# EAGLE design LED-card-1E (EAGLE 7.7.0)
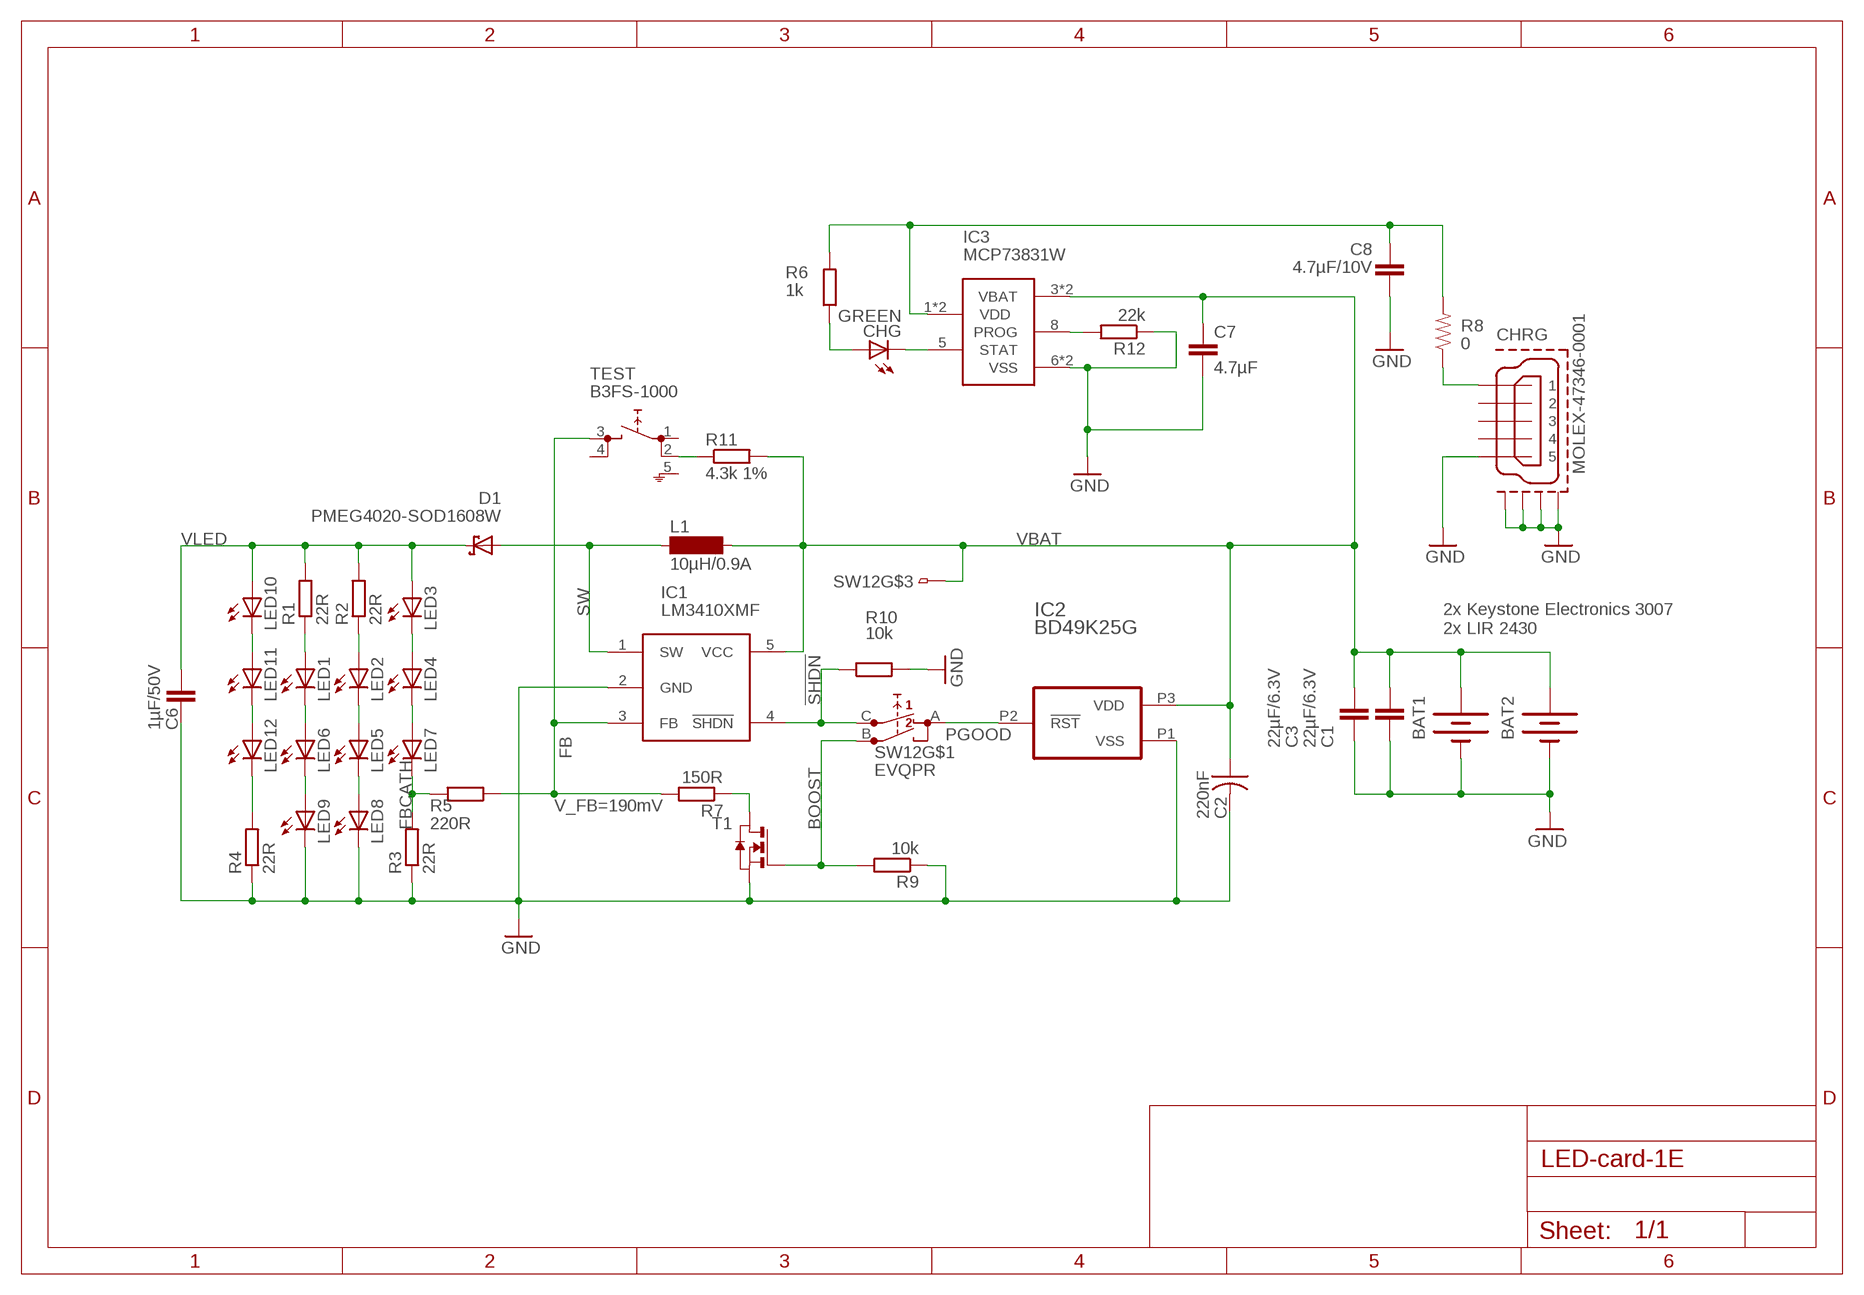
[diagram p0: schematic, sheet 1]

## Parts
BAT1  BATTERY  [BATTCON_245MM]
BAT2  BATTERY  [BATTCON_245MM]
C1  22µF/6.3V  C-EUC0805K  [C0805K]
C2  220nF  C-USC0805K  [C0805K]
C3  22µF/6.3V  C-EUC0805K  [C0805K]
C6  1µF/50V  C-EUC0805K  [C0805K]
C7  4.7µF  C-EUC0603K  [C0603K]
C8  4.7µF/10V  C-EUC0603K  [C0603K]
CHG  GREEN  LEDCHIPLED-0603-TTW  [CHIPLED-0603-TTW]
CHRG  MOLEX-47346-0001  [MOLEX-47364-0001]
D1  PMEG4020-SOD1608W  [SOD1608W]
IC1  LM3410XMF  FAN5333  [SOT23-5L]
IC2  BD49K25G  BD49KG  [SOT-23]
IC3  MCP73831W  [DFN8W]
L1  10µH/0.9A  MS50  [MS50]
LED1  LEDSML1206  [SML1206]
LED2  LEDSML1206  [SML1206]
LED3  LEDSML1206  [SML1206]
LED4  LEDSML1206  [SML1206]
LED5  LEDSML1206  [SML1206]
LED6  LEDSML1206  [SML1206]
LED7  LEDSML1206  [SML1206]
LED8  LEDSML1206  [SML1206]
LED9  LEDSML1206  [SML1206]
LED10  LEDSML1206  [SML1206]
LED11  LEDSML1206  [SML1206]
LED12  LEDSML1206  [SML1206]
R1  22R  R-EU_R0805  [R0805]
R2  22R  R-EU_R0805  [R0805]
R3  22R  R-EU_R0805  [R0805]
R4  22R  R-EU_R0805  [R0805]
R5  220R  R-EU_R0603  [R0603]
R6  1k  R-EU_R0603  [R0603]
R7  150R  R-EU_R0603  [R0603]
R8  0  RESISTOR0805-RES  [0805]
R9  10k  R-EU_R0603  [R0603]
R10  10k  R-EU_R0603  [R0603]
R11  4.3k 1%  R-EU_R0603  [R0603]
R12  22k  R-EU_R0603  [R0603]
SW12  EVQPR  [EVQPR-GND]
T1  NMOSSOT23  [SOT-23]
TEST  B3FS-1000  SKHMPSE010  [SKHMPXE010]

## Nets
!SHDN: IC1.4(!SHDN) R10.1 SW12.C(1.1)
BOOST: R9.2 SW12.B(1.2) T1.3(G)
FB: IC1.3(FB) R5.1 R7.2 TEST.3(2.1)
FBCATH: LED7.C R3.2 R5.2
FBLO: R7.1 T1.1(D)
GND: BAT1.2(-) BAT2.2(-) C1.2 C2.2 C3.2 C6.2 C7.2 C8.2 CHRG.5 CHRG.GND1 CHRG.GND2 CHRG.GND3 CHRG.GND4 IC1.2(GND) IC2.P1(VSS) IC3.6(VSS) IC3.GND(VSS) LED8.C LED9.C R3.1 R4.1 R9.1 R10.2 R12.1 T1.2(S)
N$1: R11.1 TEST.2(1.2)
N$2: IC3.8(PROG) R12.2
N$3: LED1.A R1.1
N$4: LED3.C LED4.A
N$5: LED2.C LED5.A
N$6: LED1.C LED6.A
N$7: LED6.C LED9.A
N$8: LED5.C LED8.A
N$9: LED4.C LED7.A
N$10: CHG.C@1(C) IC3.5(STAT)
N$12: LED2.A R2.1
N$13: CHG.A@1(A) R6.1
N$15: CHRG.1 R8.1
N$16: LED10.C LED11.A
N$17: LED11.C LED12.A
N$18: LED12.C R4.2
PGOOD: IC2.P2(!RST) SW12.A(2.1)
SW: D1.A D1.A2(A) IC1.1(SW) L1.1
VBAT: BAT1.1(+) BAT1.3(+) BAT2.1(+) BAT2.3(+) C1.1 C2.1 C3.1 C7.1 IC1.5(VCC) IC2.P3(VDD) IC3.3(VBAT) IC3.4(VBAT) L1.2 R11.2 SW12.D
VBUS: C8.1 IC3.1(VDD) IC3.2(VDD) R6.2 R8.2
VLED: C6.1 D1.C D1.C2(C) LED3.A LED10.A R1.2 R2.2
Unconnected: CHRG.2 CHRG.3 CHRG.4 SW12.G(SH) TEST.1(1.1) TEST.4(2.2) TEST.5(SH)

## Notes on the sheet
- 2x Keystone Electronics 3007
  2x LIR 2430
- V_FB=190mV

## Library data of the parts
BAT1 BAT2 = custom-parts:BATTERY: Battery Holders Various common sizes : AA, AAA, 20mm coin cell and 12mm coin cell. 20MM_4LEGS, BATT-10373; MF: Keystone Electronics; MOUSER: 534-3007; MPN: 3007
C1 C3 C6-C8 = rcl:C-EU: CAPACITOR, European symbol
C2 = rcl:C-US: CAPACITOR, American symbol
CHG = led:LED: LED OSRAM: - CHIPLED LG R971, LG N971, LY N971, LG Q971, LY Q971, LO R971, LY R971 LH N974, LH R974 LS Q976, LO Q976, LY Q976 LO Q996 - Hyper CHIPLED LW Q18S LB Q993, LB Q99A, LB R99A - SideLED LS A670, LO A670, LY A670, LG A670, LP A670 LB A673, LV A673, LT A673, LW A673 LH A674 LY A675 LS A676, LA A676, LO A676, LY A676, LW A676 LS A679, LY A679, LG A679 - Hyper Micro SIDELED® LS Y876, LA Y876, LO Y876, LY Y876 LT Y87S - SmartLED LW L88C, LW L88S LB L89C, LB L89S, LG L890 LS L89K, LO L89K, LY L89K LS L896, LA L896, LO L896, LY L896 - TOPLED LS T670, LO T670, LY T670, LG T670, LP T670 LSG T670, LSP T670, LSY T670, LOP T670, LYG T670 LG T671, LOG T671, LSG T671 LB T673, LV T673, LT T673, LW T673 LH T674 LS T676, LA T676, LO T676, LY T676, LB T676, LH T676, LSB T676, LW T676 LB T67C, LV T67C, LT T67C, LS T67K, LO T67K, LY T67K, LW E67C LS E67B, LA E67B, LO E67B, LY E67B, LB E67C, LV E67C, LT E67C LW T67C LS T679, LY T679, LG T679 LS T770, LO T770, LY T770, LG T770, LP T770 LB T773, LV T773, LT T773, LW T773 LH T774 LS E675, LA E675, LY E675, LS T675 LS T776, LA T776, LO T776, LY T776, LB T776 LHGB T686 LT T68C, LB T68C - Hyper Mini TOPLED® LB M676 - Mini TOPLED Santana® LG M470 LS M47K, LO M47K, LY M47K Source: http://www.osram.convergy.de LUXEON: - LUMILED® LXK2-PW12-R00, LXK2-PW12-S00, LXK2-PW14-U00, LXK2-PW14-V00 LXK2-PM12-R00, LXK2-PM12-S00, LXK2-PM14-U00 LXK2-PE12-Q00, LXK2-PE12-R00, LXK2-PE12-S00, LXK2-PE14-T00, LXK2-PE14-U00 LXK2-PB12-K00, LXK2-PB12-L00, LXK2-PB12-M00, LXK2-PB14-N00, LXK2-PB14-P00, LXK2-PB14-Q00 LXK2-PR12-L00, LXK2-PR12-M00, LXK2-PR14-Q00, LXK2-PR14-R00 LXK2-PD12-Q00, LXK2-PD12-R00, LXK2-PD12-S00 LXK2-PH12-R00, LXK2-PH12-S00 LXK2-PL12-P00, LXK2-PL12-Q00, LXK2-PL12-R00 Source: www.luxeon.com KINGBRIGHT: KA-3528ASYC Source: www.kingbright.com
CHRG = usb_con-update:MOLEX-47346-0001: MICRO USB B, BOTTOM MOUNT
D1 = custom-parts:PMEG4020: SOD123W Schottky Rectifier; MF: Nexperia; MOUSER: 771-PMEG4020EPK,315; PN: PMEG4020EPK,315
IC1 = custom-parts:FAN5333; MF: Ti; MOUSER: 926-LM3410XMF/NOPB; MPN: LM3410XMF
IC2 = custom-parts:BD49K**G: Standard CMOS Voltage Detector IC Package Type SSOP3(1pin GND) variant Datasheet http://www.mouser.com/ds/2/348/bd48xxg-e-746174.pdf
IC3 = custom-parts:MCP73831: Miniature Single-Cell, Fully Integrated Li-Ion, Li-Polymer Charge Management Controllers
L1 = inductor-neosid:MS50: INDUCTOR SMD power inductor; MF: Taiyo Yuden; MOUSER: CBC3225T100KR; MPN: CBC3225T100KR; OC_FARNELL: unknown; OC_NEWARK: unknown
LED1-LED12 = led:LED: LED OSRAM: - CHIPLED LG R971, LG N971, LY N971, LG Q971, LY Q971, LO R971, LY R971 LH N974, LH R974 LS Q976, LO Q976, LY Q976 LO Q996 - Hyper CHIPLED LW Q18S LB Q993, LB Q99A, LB R99A - SideLED LS A670, LO A670, LY A670, LG A670, LP A670 LB A673, LV A673, LT A673, LW A673 LH A674 LY A675 LS A676, LA A676, LO A676, LY A676, LW A676 LS A679, LY A679, LG A679 - Hyper Micro SIDELED® LS Y876, LA Y876, LO Y876, LY Y876 LT Y87S - SmartLED LW L88C, LW L88S LB L89C, LB L89S, LG L890 LS L89K, LO L89K, LY L89K LS L896, LA L896, LO L896, LY L896 - TOPLED LS T670, LO T670, LY T670, LG T670, LP T670 LSG T670, LSP T670, LSY T670, LOP T670, LYG T670 LG T671, LOG T671, LSG T671 LB T673, LV T673, LT T673, LW T673 LH T674 LS T676, LA T676, LO T676, LY T676, LB T676, LH T676, LSB T676, LW T676 LB T67C, LV T67C, LT T67C, LS T67K, LO T67K, LY T67K, LW E67C LS E67B, LA E67B, LO E67B, LY E67B, LB E67C, LV E67C, LT E67C LW T67C LS T679, LY T679, LG T679 LS T770, LO T770, LY T770, LG T770, LP T770 LB T773, LV T773, LT T773, LW T773 LH T774 LS E675, LA E675, LY E675, LS T675 LS T776, LA T776, LO T776, LY T776, LB T776 LHGB T686 LT T68C, LB T68C - Hyper Mini TOPLED® LB M676 - Mini TOPLED Santana® LG M470 LS M47K, LO M47K, LY M47K Source: http://www.osram.convergy.de LUXEON: - LUMILED® LXK2-PW12-R00, LXK2-PW12-S00, LXK2-PW14-U00, LXK2-PW14-V00 LXK2-PM12-R00, LXK2-PM12-S00, LXK2-PM14-U00 LXK2-PE12-Q00, LXK2-PE12-R00, LXK2-PE12-S00, LXK2-PE14-T00, LXK2-PE14-U00 LXK2-PB12-K00, LXK2-PB12-L00, LXK2-PB12-M00, LXK2-PB14-N00, LXK2-PB14-P00, LXK2-PB14-Q00 LXK2-PR12-L00, LXK2-PR12-M00, LXK2-PR14-Q00, LXK2-PR14-R00 LXK2-PD12-Q00, LXK2-PD12-R00, LXK2-PD12-S00 LXK2-PH12-R00, LXK2-PH12-S00 LXK2-PL12-P00, LXK2-PL12-Q00, LXK2-PL12-R00 Source: www.luxeon.com KINGBRIGHT: KA-3528ASYC Source: www.kingbright.com; MF: WE; MOUSER: 710-158301260; MPN: 158301260
R1-R7 R9-R12 = rcl:R-EU_: RESISTOR, European symbol
R8 = SparkFun-Passives:RESISTOR: Resistor Basic schematic elements and footprints for 0603, 1206, and PTH resistors.
SW12 = custom-parts:EVQPR: Panasonic Light Touch Switches/EVQPR/Q0/3PR Features optional boss (EVQP-R7, EVQ-3PR, EVQ-PR9, EVQ-PRH) optional GND shield terminal (EVQP-PR5, EVQP- PRD, EVQP-PR9, EVQP-PRH) optional push plate (A10) Datasheet all models : EVQP-PRBA10, EVQP-Q04A10, EVQP-PR7A10, EVQP-3PRA10, EVQP-PR5A10, EVQP-PRDA10, EVQP-PR9A10, EVQP-PRHA10, EVQP-PRBA09, EVQP-Q04A09, EVQP-PR7A09, EVQP-3PRA09, EVQP-PR5A09, EVQP-PRDA09, EVQP-PR9A09, EVQP-PRHA09 http://www.mouser.com/ds/2/315/ATK0000CE21-1099498.pdf; MF: PANASONIC; MF_PARTNO: EVQ-PRHA09; MOUSER: 667-EVQ-PRHA09
T1 = zetex:NMOSSOT23: MOS FET; OC_FARNELL: unknown; OC_NEWARK: unknown
TEST = switch:SKHMP*E010: 6.2 X 6.5mm TACT Switch (SMD) Source: http://www3.alps.co.jp/WebObjects/catalog.woa/PDF/E/Switch/Tact/SKHM/SKHM.PDF; MF: OMRON; MOUSER: 653-B3FS-1000; MPN: B3FS-1000

## Net classes
0 default: width 0.2 mm, drill 0.3 mm, clearance 0.15 mm
1 copper pour GND: width 0.2 mm, drill 0.3 mm, clearance 0.15 mm to class 0, clearance 0.15 mm
2 copper pour +5V: width 0.2 mm, drill 0.3 mm, clearance 0.15 mm to class 0, clearance 0.15 mm to class 1, clearance 0.15 mm

## Board
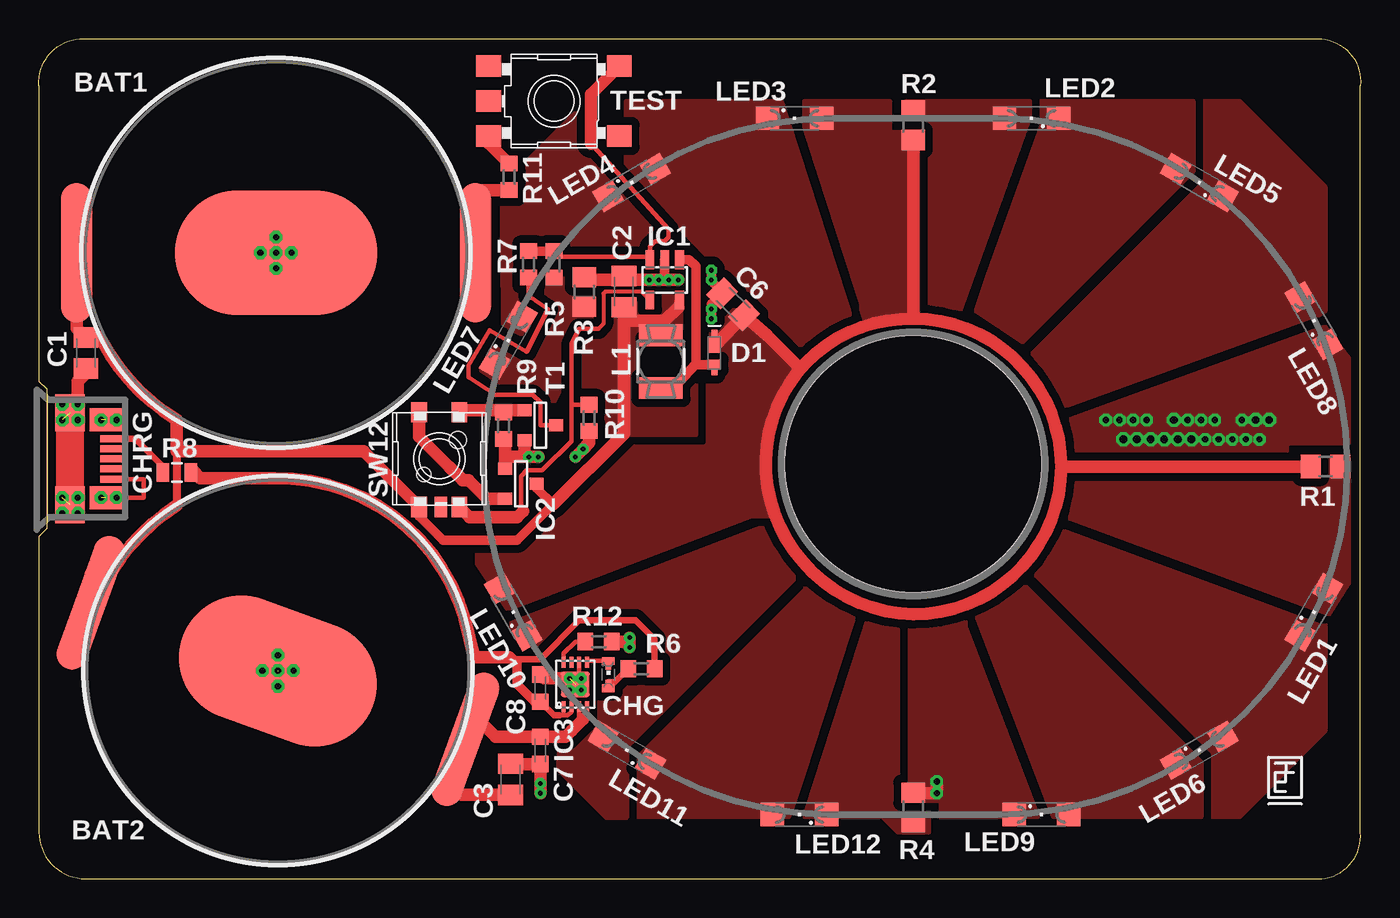
[diagram p1: board, top side]
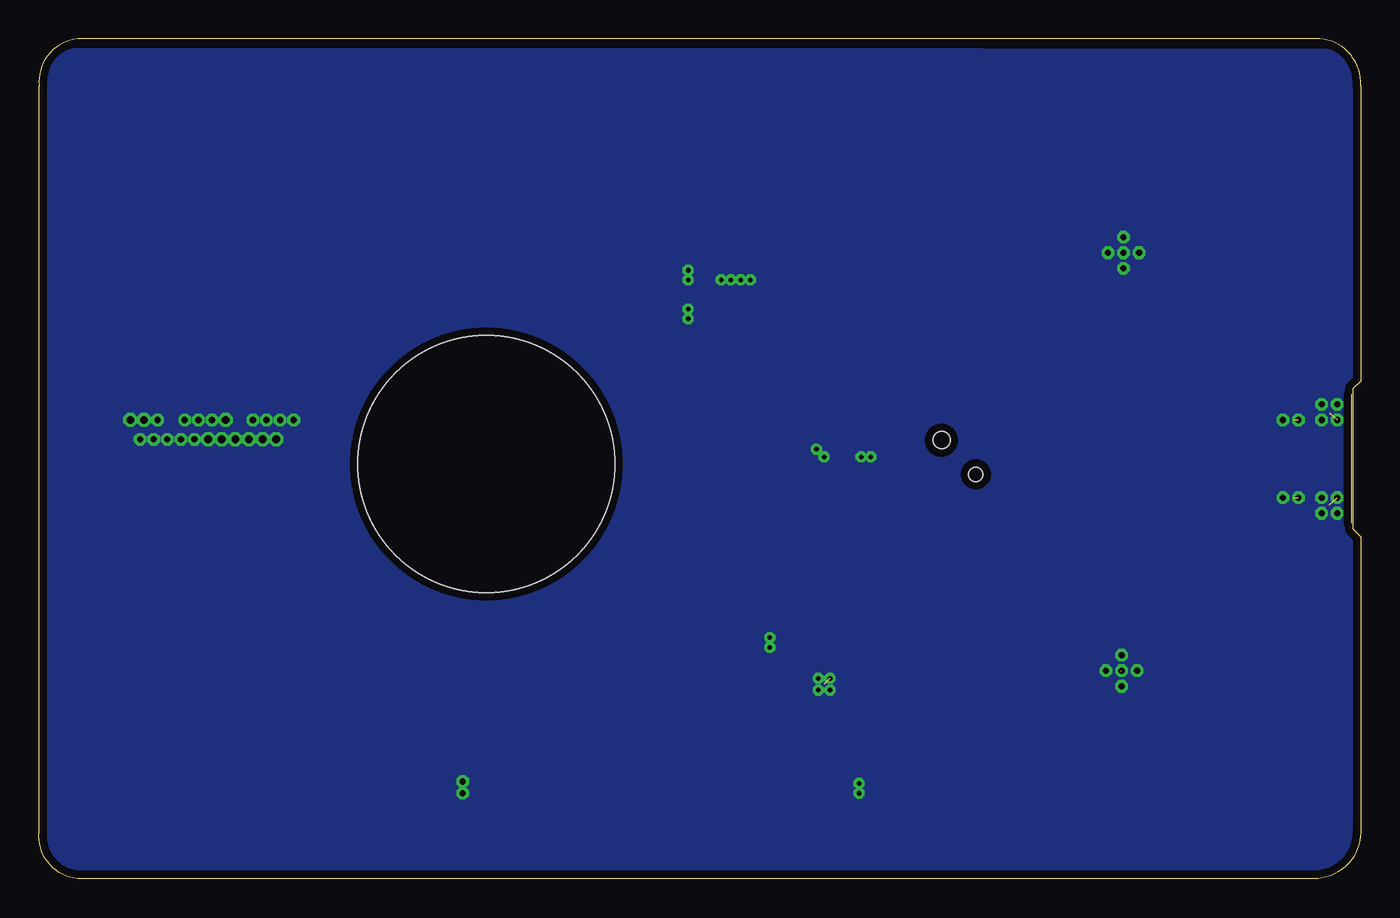
[diagram p2: board, bottom side, seen from below]

Size 85.02 x 54 mm. Coordinates in mm from the lower left corner, seen from the top.
Outline: 0.01,51 0.01,32 0.51,31.5 0.51,22.5 0.01,22 0.01,3 arc90 3.01,0 82.51,0 arc90 85.01,3 85.01,51 arc90 82.51,54 2.63,54 arc90 0.01,51
Copper layers (1*16): Top 0.035mm / dielectric 1.5mm / Bottom 0.035mm
Design rules "DFRobot_Eagle_Rule_v0.4": minimum track width 6mil, minimum drill 12mil, track to track 6mil, track to pad 6mil, pad to pad 6mil, via to via 6mil, smd to smd 0mil, copper to edge 10mil, drill to drill 10mil, minimum pad ring 12mil, minimum via ring 8mil, stop-mask expansion 2mil, vias tented up to drill 25mil, thermal gap 10mil
Holes 16.5 mm at 56.23,26.67
tRestrict: area 38.9,31.8 to 41.1,34.8

### Footprints (pad centres in the part's own frame; a part is rotated, then mirrored left to right if it is on the bottom)
BATTCON_245MM = smd 2 x 9: 1 -12.827,0; 3 12.827,0 | smd 13 x 8: 2 0,0
C0805K = smd 1.3 x 1.6: 1 -1,0; 2 1,0
C0603K = smd 1.05 x 1.08: 1 -0.875,0; 2 0.875,0
CHIPLED-0603-TTW = smd 0.8 x 0.5: A 0,-0.875; C 0,0.875 | smd 0.35 x 0.35: A@1 0,-0.5; C@1 0,0.5
MOLEX-47364-0001 = smd 1.7 x 0.45: 1 2.8,1.3; 2 2.8,0.65; 3 2.8,0; 4 2.8,-0.65; 5 2.8,-1.3 | smd 1.9 x 2.375: GND1 0,2.95; GND4 0,-2.95 | smd 2.1 x 1.475: GND2 2.3,2.5; GND3 2.3,-2.5
SOD1608W = smd 0.65 x 0.8: A 0.7,0 | smd 0.762 x 0.381: A2 1.016,0; C2 -1.143,0 | smd 1.05 x 0.8: C -0.6,0
SOT23-5L = smd 0.55 x 1.2: 1 -0.95,-1.3; 2 0,-1.3; 3 0.95,-1.3; 4 0.95,1.3; 5 -0.95,1.3
SOT-23 = smd 0.787 x 0.889: P1 -0.991,-1.016; P2 0.94,-1.016; P3 -0.025,1.016
DFN8W = smd 0.25 x 0.7: 1 -0.75,-1.425; 2 -0.25,-1.425; 3 0.25,-1.425; 4 0.75,-1.425; 5 0.75,1.425; 6 0.25,1.425; 7 -0.25,1.425; 8 -0.75,1.425 | smd 1.85 x 1.65: GND 0,0
MS50 = smd 2.8 x 1.4: 1 0,-1.7; 2 0,1.7
SML1206 = smd 1.5 x 1.5: A 1.75,0; C -1.75,0
R0805 = smd 1.3 x 1.5: 1 -0.95,0; 2 0.95,0
R0603 = smd 1 x 1.1: 1 -0.85,0; 2 0.85,0
0805 = smd 0.8 x 1.2: 1 -0.9,0; 2 0.9,0
EVQPR-GND = smd 1.3 x 1: A -3,-1.3; B -3,1.3; C 3.1,1.3; D 3.1,-1.3 | smd 1.3 x 0.8: G 3.1,0.1 | hole 1.1: -1.2,1.2 | hole 0.9: 1,-1
SOT-23' = smd 0.787 x 0.889: 1 0.025,-1.016; 2 -0.94,1.016; 3 0.991,1.016
SKHMPXE010 = smd 1.6 x 1.4: 1 -4.2,2.25; 2 4.2,2.25; 3 -4.2,-2.25; 4 4.2,-2.25; 5 4.2,0

### Placement (x,y rotation side)
BAT1  15.26,40.25 0 top
BAT2  15.38,13.35 340 top
C1  3.03,33.8 270 top
C2  37.63,37.75 90 top
C3  30.34,6.38 90 top
C6  44.66,36.93 135 top
C7  32.26,8.25 270 top
C8  32.26,12.25 90 top
CHG  36.63,13.12 0 top
CHRG  2.01,27 0 top
D1  43.45,33.76 270 top
IC1  40.26,38.5 180 top
IC2  31.01,25.38 270 top
IC3  34.51,12.5 0 top
L1  40.01,33.25 0 top
LED1  82.02,17.14 60 top
LED2  63.85,48.9 180 top
LED3  48.61,48.9 0 top
LED4  38.13,44.77 30 top
LED5  74.65,44.77 150 top
LED6  74.65,8.26 30 top
LED7  30.2,34.61 60 top
LED8  82.02,35.88 120 top
LED9  64.49,4.13 0 top
LED10  30.51,17.14 120 top
LED11  37.82,8.26 150 top
LED12  48.93,4.13 180 top
R1  82.76,26.5 180 top
R2  56.23,48.44 270 top
R3  35.09,37.73 270 top
R4  56.23,4.58 270 top
R5  33.13,39.5 270 top
R6  38.76,13.5 0 top
R7  31.51,39.5 90 top
R8  8.88,26.12 0 top
R9  29.88,29.12 90 top
R10  35.38,29.62 270 top
R11  30.26,45.12 270 top
R12  36.01,15.25 180 top
SW12  25.76,27 270 top
T1  [SOT-23']  32.26,29.12 90 top
TEST  33.13,50 180 top
U$1  [DESIGNER]  79.13,5.25 0 top

### Tracks (layer width: path | path; a pad name or v marks a point on that pad's centre or on a via)
!SHDN
  Top 0.254: IC1.4 38.76,37.75 36.44,37.75 36.32,37.62 36.32,35.69 36.01,35.38
  Top 0.305: 36.01,35.38 34.76,35.38 34.26,34.38 34.26,32.5 | 31.13,23.62 31.13,23.88 31.01,24 31.01,25.88 31.38,26.25 32.38,26.25 34.26,28.12 34.26,30.48 | 34.26,30.48 34.26,32.5 | 34.26,32.5 34.26,30.48 | 34.26,30.48 R10.1
  Top 0.813: 27.08,23.88 SW12.C 27.71,23.25 30.76,23.25 31.13,23.62
BOOST
  Top 0.813: SW12.B 27.19,30.12 29.88,30.12 | 29.88,30.12 T1.3 | R9.2 29.88,30.12
FB
  Top 0.305: R5.1 33.48,40 39.13,40 39.31,39.83 IC1.3 39.31,40.67 39.63,41 40.26,41 40.51,41.25 40.51,41.75 35.63,47.12 35.51,47.25
  Top 0.61: R7.2 R5.1
  Top 0.813: TEST.3 35.51,50.42 35.51,47.25
FBCATH
  pour Top (isolate 0.508, rank 2, no thermals): 28.26,34.5 28.26,30.5 33.01,30.5 35.76,36 35.76,38.5 33.01,38.5 30.88,34.5
FBLO
  Top 0.305: R7.1 31.51,37.5 32.76,36.62 31.38,33.88 29.01,35.25 27.63,33 27.63,32.25 29.38,31.12 31.76,31.12 32.26,30.62 32.26,29.17 T1.1
GND  (via drill 0.3, 0.4, 0.5)  (6 unrouted)
  Top 0.305: CHRG.5 6.76,25.7 6.76,24.5 v5.01,24.5 | IC3.6 34.76,13 v34.88,12.88 | 31.24,27.39 v31.51,27.12 | 29.88,27.23 29.99,27.12
  Top 0.6: IC1.2 40.26,38.5 v40.51,38.5
  Top 0.61: C6.2 43.26,36.96 v43.26,36.62 v43.26,36 | v43.26,39.12 v43.26,38.5 43.26,38.41 43.88,37.79
  Top 0.813: v57.76,6.25 v57.76,5.5 56.23,5.5 R4.1 | C1.2 3.26,32.8 2.51,32 v2.51,30.5 | v2.51,23.5 2.46,23.5 | v41.13,38.5 v40.51,38.5 37.81,38.5 C2.2 37.55,38.8 37.01,38.5 35.26,38.5 35.13,38.62 R3.1 | C8.2 32.51,12.88 v34.13,12.88 | 32.26,5.62 v32.26,5.5 v32.26,6.12 C7.2 30.35,7.38 C3.2 | R12.1 38.01,15.25 | v38.01,15.5 38.01,15.25 | 38.01,15.25 v38.01,14.88 | v32.13,27.12 v31.51,27.12 29.99,27.12 IC2.P1 29.99,28.27 R9.1 | v34.51,27.12 v35.01,27.62 35.38,28.02 R10.2 | T1.2 31.24,27.39 | 43.88,37.79 43.88,37.62
  other vias: 1.51,30.5 2.51,29.5 1.51,29.5 2.51,24.5 1.51,24.5 1.51,23.5 4.01,24.5 5.01,29.5 4.01,29.5 15.26,40.25 16.26,40.25 14.26,40.25 15.26,39.25 15.26,41.25 15.38,13.38 16.38,13.38 14.38,13.38 15.38,14.38 15.38,12.38 69.51,29.5 68.63,29.5 39.88,38.5 34.13,12.12 34.88,12.12 70.38,29.5 71.26,29.5 73.01,29.5 73.88,29.5 74.76,29.5 75.63,29.5 77.38,29.5 78.26,29.5 79.13,29.5 69.76,28.25 75.01,28.25 75.88,28.25 76.76,28.25 77.63,28.25 78.51,28.25 70.63,28.25 71.51,28.25 72.38,28.25 73.26,28.25 74.13,28.25 39.26,38.5
  pour Bottom (isolate 0.508, rank 4, no thermals): 85.1,53.34 24.45,53.34 0.14,53.3 0.32,0.32 85.1,0.32
  pour Top (isolate 0.508, no thermals): 66.26,29.5 82.76,35.5 84.26,33.5 84.26,28 80.26,28 80.26,27.5 66.76,27.5
  pour Top (isolate 0.508, rank 2, no thermals): 55.76,16 55.76,5 57.76,5 57.76,4 64.26,4 59.76,16.5
N$1
  Top 0.813: R11.1 28.93,47.3 TEST.2
N$2
  Top 0.305: R12.2 34.51,15.25 33.76,14.5 IC3.8
N$3
  pour Top (isolate 0.508, no thermals): 66.76,25.5 82.76,25.5 82.76,27 84.26,27 84.26,19 83.01,17 66.13,23.25
N$4
  pour Top (isolate 0.508, no thermals): 47.76,50 52.26,36 48.76,34 37.76,45.5 37.76,50
N$5
  pour Top (isolate 0.508, rank 2, no thermals): 64.26,50 64.26,48.5 60.26,36.5 63.26,34.5 74.26,45.5 74.26,50
N$6
  pour Top (isolate 0.508, rank 2, no thermals): 66.01,22.75 82.76,16.5 82.76,9.5 77.26,4 75.26,4 75.26,8 63.76,19
N$7
  pour Top (isolate 0.508, no thermals): 63.26,19 74.76,7.5 74.76,4 65.26,4 60.26,17
N$8
  pour Top (isolate 0.508, rank 3, no thermals): 74.76,50 74.76,45 63.76,34 65.76,30 81.26,35.5 82.76,36.5 82.76,44.5 77.26,50
N$9
  pour Top (isolate 0.508, rank 4, no thermals): 37.26,50 37.26,45 41.13,41.12 41.13,40.5 32.51,40.38 32.63,34.12 31.88,33.38 29.88,34.12 29.76,44.5 35.26,50
N$10
  Top 0.305: IC3.5 35.33,14 36.38,14 CHG.C@1
N$12
  pour Top (isolate 0.508, no thermals): 63.76,50 55.76,50 55.76,48.75 57.13,48.75 57.26,37 59.26,36.5 63.76,49
N$13
  Top 0.406: CHG.A@1 37.03,12.62 R6.1
N$15
  Top 0.406: CHRG.1 6.21,28.3 7.98,26.52 R8.1
N$16
  pour Top (isolate 0.508, no thermals): 30.38,16.38 31.51,14.62 31.63,10.25 31.63,8.88 36.51,4 37.76,4 37.76,8.5 48.63,19.38 46.76,22.62
N$17
  pour Top (isolate 0.508, rank 2, no thermals): 49.26,19 52.76,17 48.26,4 38.26,4 38.26,8
N$18
  pour Top (isolate 0.508, no thermals): 53.26,16.5 55.26,16 55.26,4.5 57.26,4.5 57.26,3 55.26,3 54.26,4 49.26,4
PGOOD
  Top 0.813: SW12.A 24.46,28.43 26.38,26.5 27.11,25.77 27.26,25.62 27.63,25.62 28.82,24.43 IC2.P2
SW
  Top 0.61: IC1.1 41.83,39.8 42.26,39.38 42.26,34.55 42.26,33.12 | 42.26,33.12 41.13,31.88 40.68,31.93 L1.1 | D1.A 42.32,33.06 42.26,33.12
VBAT
  Top 0.305: IC3.3 34.76,10.25 35.01,10.25 35.26,10.25 IC3.4
  Top 0.508: 8.88,27.5 8.88,25.12 8.88,24 | 41.13,36.75 41.13,37.12 IC1.5
  Top 0.61: SW12.D 24.46,23.3 26.01,21.75 30.76,21.75 33.07,24.06 32.02,25.11 IC2.P3 | L1.2 40.01,35.88
  Top 0.813: 10.01,27.5 20.88,27.5 24.46,23.93 SW12.D | 35.01,10.25 34.26,9.5 33.88,9.12 C7.1 29.36,9.12 28.01,10.48 | 26.13,5.38 26.41,6.16 | 26.41,6.16 BAT2.3 | 10.01,27.5 8.88,27.5 | BAT1.1 2.43,35.4 C1.1 3.26,34.88 3.76,34.88 4.08,34.55 arc30 8.88,29.5 8.88,27.5 | 10.01,27.5 8.88,27.5 | 8.88,24 arc30 4.26,19 3.33,19.57 BAT2.1 | 26.76,5.62 27.43,7.45 BAT2.3 | BAT2.3 28.01,10.48 | 28.01,10.48 28.26,11.12 | 37.79,36.72 37.88,35.88 40.01,35.88 40.26,35.88 41.13,36.75 | C2.1 37.63,28.62 33.07,24.06 | C3.1 27.19,5.38 26.41,6.16 | R11.2 28.28,44.27 28.13,44.12 28.13,40.3 BAT1.3
  pour Top (isolate 0.508, no thermals): 37.26,37.75 42.26,37.75 42.26,28.5 34.63,28.5 34.63,35.75 35.26,35.75
VBUS
  Top 0.305: IC3.1 33.76,10.5 | 33.76,10.5 33.51,10.5 | IC3.2 34.26,10.75 34.01,10.5 33.76,10.5 | 30.7,14.12 30.38,14.25 30.26,14.12 30.26,14.25
  Top 0.406: 33.51,10.5 33.13,10.5 32.23,11.37 32.23,11.38 C8.1 | R6.2 39.61,15.4 38.38,16.62 34.76,16.62 32.26,14.12 30.7,14.12
  Top 0.61: C8.1 31.88,11.38 30.76,12.5 30.76,13.88 30.38,14.25
  Top 0.813: 30.26,14.25 28.01,14.25 27.38,16.75 arc75 15.13,25.75 10.38,25.75 9.91,26.25 R8.2
VLED
  Top 0.406: 48.76,33 47.01,29.25 46.76,27
  Top 0.813: 56.26,36 arc90 46.76,27 arc90 56.26,17 arc90 65.76,26.5 | 56.26,36 arc-90 65.76,26.5 | 65.76,26.5 R1.2 | R2.2 56.26,47.49 56.26,36 | 48.76,33 46.82,34.93 C6.1 43.45,34.23 D1.C
  pour Top (isolate 0.508, rank 2, no thermals): 49.26,50 54.76,50 54.76,48 56.76,48 56.76,36.5 53.26,35.5 49.26,48
  pour Top (isolate 0.508, rank 5, no thermals): 37.76,32 42.63,31.88 42.63,36.5 45.13,36.5 48.63,32.75 46.88,30.12 47.01,23.25 30.26,17.25 28.26,20.25 28.13,31.88
(copper drawn outside any net)
  shapes: Top area x1